# Altium schematic sheet POWER.SchDoc
size Letter
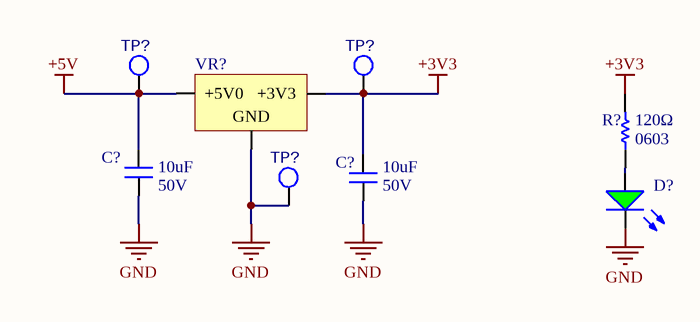
[diagram p0: POWER.SchDoc]

## Parts
(Parts that share a designator on the sheet are numbered #1, #2 ... from top to bottom, then left to right.)
C?#1  Voltage Rating: 50V  [CAPC1206(3216)]  (hidden comment: 10uF)
C?#2  Voltage Rating: 50V  [CAPC1206(3216)]  (hidden comment: 10uF)
D?  (no value)  [LED_0805_LINE]
R?  value 120Ω  Case/Package: 0603  [RESC0603(1608)_N]
TP?#1  *  [TESTPOINT_LOOP]  (value not drawn)
TP?#2  *  [TESTPOINT_LOOP]  (value not drawn)
TP?#3  *  [TESTPOINT_LOOP]  (value not drawn)
VR?  (no value)  [D2PAK_M]

## Nets
+3V3: C?#2.2 R?.2 TP?#2.1 VR?.2(+3V3)
+5V: C?#1.1 TP?#1.1 VR?.3(+5V0)
GND: C?#1.2 C?#2.1 D?.2(K) TP?#3.1 VR?.1(GND)
NetD?_1: D?.1(A) R?.1

## Notes on the sheet
- Title
- Size:
- Date:
- Letter
- Drawn By:
- Sheet
- of
- File:

## Library data of the parts
C?#1 C?#2 = CAP_10uF_50V_1206: CAP CER 10UF 50V X5R 1206; Manufacturer Part Numer 1: GRT31CR61H106KE01L; Manufacturer 1: Murata; Dimensions: 0.126" L x 0.063" W (3.20mm x 1.6mm); Package: 1206 (3216 Metric); Supplier Part Number 1: 490-12456-1-ND; Supplier 1: Digi-Key; Mount: Surface Mount; Value: 10uF
D? = DIO_LED_G: LED GREEN DIFFUSED 0805 SMD; Manufacturer Part Number 1: LG R971-KN-1; Manufacturer 1: OSRAM; Forward Voltage Drop: 2.2V; Package: 0805 (2012 Metric); Supplier Part Number 1: 475-1410-1-ND; Supplier 1: Digi-Key; Mount: Surface Mount
R? = RES_120Ω_0603: RES SMD 120 OHM 5% 1/10W 0603; Manufacturer 1: Yageo; Manufacturer Part Number 1: RC0603JR-07120RL; Package: 0603 (1608 Metric); Dimensions: 0.063" L x 0.031" W (1.60mm x 0.80mm); Supplier Part Number 1: 311-120GRCT-ND; Supplier 1: Digi-Key; Mount: Surface Mount; Case Code (Metric): 1608; Tolerance: 5%
TP?#1-TP?#3 = TESTPOINT_LOOP: Loop testpoint through-hole pad; Manufacturer 1: Keystone Electronics; Manufacturer Part Number 1: 5002; Supplier Part Number 1: 36-5002-ND; Supplier 1: Digi-Key; Mount: Through Hole
VR? = 5V0_3V3_LDO: IC REG LINEAR 3.3V 1A DPAK; Manufacturer Part Number 1: NCP1117DT33T5G; Manufacturer 1: ON Semiconductor; Current Output: 1A; Supplier Part Number 1: NCP1117DT33T5GOSCT-ND; Supplier 1: Digi-Key; Mount: Surface Mount